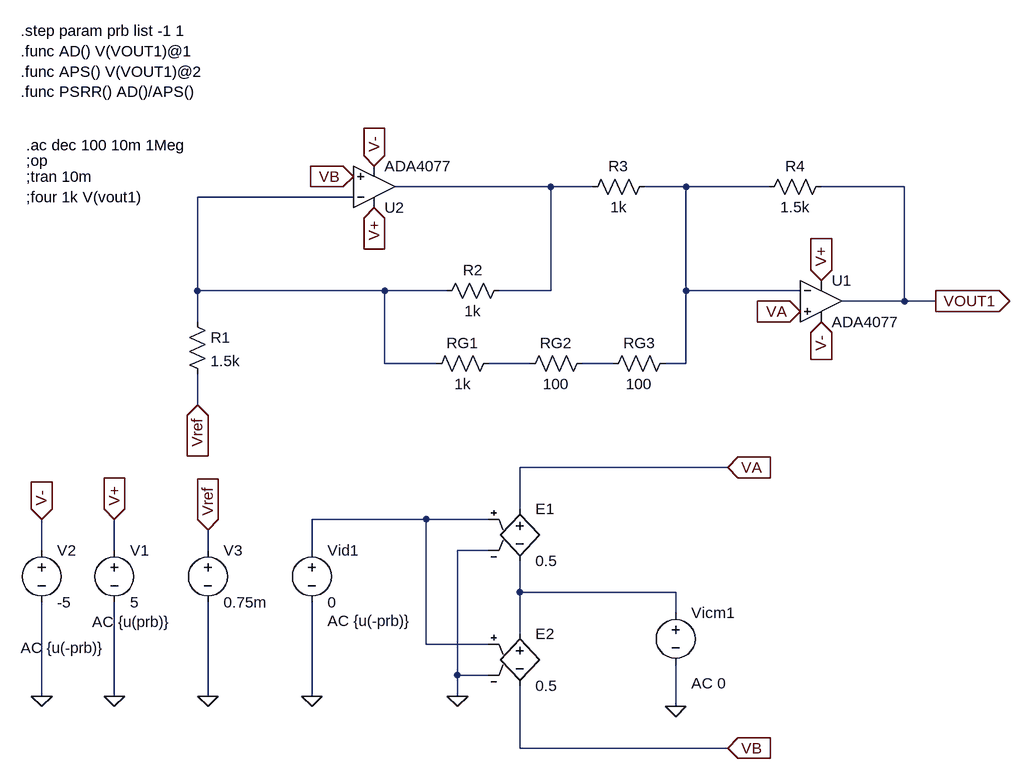
[diagram p0: schematic Etaj1PSRR.asc]
Etaj1PSRR.asc, the LTspice schematic file:
Version 4
SHEET 1 1100 776
WIRE 368 -160 128 -160
WIRE 432 -160 368 -160
WIRE 576 -160 512 -160
WIRE 704 -160 576 -160
WIRE 912 -160 784 -160
WIRE 64 -144 -176 -144
WIRE -176 0 -176 -144
WIRE 112 0 -176 0
WIRE 208 0 112 0
WIRE 368 0 368 -160
WIRE 368 0 288 0
WIRE 576 0 576 -160
WIRE 752 0 576 0
WIRE 912 16 912 -160
WIRE 912 16 816 16
WIRE 960 16 912 16
WIRE -176 48 -176 0
WIRE 112 112 112 0
WIRE 192 112 112 112
WIRE 336 112 272 112
WIRE 464 112 416 112
WIRE 576 112 576 0
WIRE 576 112 544 112
WIRE -176 176 -176 128
WIRE 640 272 320 272
WIRE 320 336 320 272
WIRE 176 352 0 352
WIRE 272 352 176 352
WIRE -416 400 -416 352
WIRE -304 400 -304 352
WIRE -160 400 -160 368
WIRE 0 400 0 352
WIRE 272 400 224 400
WIRE 320 464 320 416
WIRE 560 464 320 464
WIRE 560 496 560 464
WIRE 320 528 320 464
WIRE 176 544 176 352
WIRE 272 544 176 544
WIRE 224 592 224 400
WIRE 272 592 224 592
WIRE -416 624 -416 480
WIRE -304 624 -304 480
WIRE -160 624 -160 480
WIRE 0 624 0 480
WIRE 224 624 224 592
WIRE 560 640 560 576
WIRE 320 704 320 608
WIRE 640 704 320 704
FLAG -304 624 0
FLAG -416 624 0
FLAG -304 352 V+
IOPIN -304 352 In
FLAG -416 352 V-
IOPIN -416 352 In
FLAG 784 48 V-
IOPIN 784 48 In
FLAG 96 -192 V-
IOPIN 96 -192 In
FLAG 784 -16 V+
IOPIN 784 -16 In
FLAG 96 -128 V+
IOPIN 96 -128 In
FLAG 752 32 VA
IOPIN 752 32 In
FLAG 64 -176 VB
IOPIN 64 -176 In
FLAG 960 16 VOUT1
IOPIN 960 16 Out
FLAG 0 624 0
FLAG 224 624 0
FLAG 560 640 0
FLAG 640 272 VA
IOPIN 640 272 In
FLAG 640 704 VB
IOPIN 640 704 In
FLAG -160 368 Vref
IOPIN -160 368 In
FLAG -176 176 Vref
IOPIN -176 176 In
FLAG -160 624 0
DATAFLAG 912 16 ""
SYMBOL res -192 32 R0
SYMATTR InstName R1
SYMATTR Value 1.5k
SYMBOL res 304 -16 R90
WINDOW 0 0 56 VBottom 2
WINDOW 3 32 56 VTop 2
SYMATTR InstName R2
SYMATTR Value 1k
SYMBOL res 528 -176 R90
WINDOW 0 0 56 VBottom 2
WINDOW 3 32 56 VTop 2
SYMATTR InstName R3
SYMATTR Value 1k
SYMBOL res 800 -176 R90
WINDOW 0 0 56 VBottom 2
WINDOW 3 32 56 VTop 2
SYMATTR InstName R4
SYMATTR Value 1.5k
SYMBOL res 288 96 R90
WINDOW 0 0 56 VBottom 2
WINDOW 3 32 56 VTop 2
SYMATTR InstName RG1
SYMATTR Value 1k
SYMBOL voltage -304 384 R0
WINDOW 123 -34 126 Left 2
WINDOW 39 0 0 Left 0
SYMATTR Value2 AC {u(prb)}
SYMATTR InstName V1
SYMATTR Value 5
SYMBOL voltage -416 384 R0
WINDOW 123 -32 166 Left 2
WINDOW 39 0 0 Left 0
SYMATTR Value2 AC {u(-prb)}
SYMATTR InstName V2
SYMATTR Value -5
SYMBOL e 320 320 R0
SYMATTR InstName E1
SYMATTR Value 0.5
SYMBOL e 320 512 R0
SYMATTR InstName E2
SYMATTR Value 0.5
SYMBOL voltage 560 480 R0
WINDOW 123 24 124 Left 2
WINDOW 39 0 0 Left 0
SYMATTR Value2 AC 0
SYMATTR InstName Vicm1
SYMATTR Value ""
SYMBOL voltage 0 384 R0
WINDOW 123 24 124 Left 2
WINDOW 39 0 0 Left 0
SYMATTR Value2 AC {u(-prb)}
SYMATTR InstName Vid1
SYMATTR Value 0
SYMBOL voltage -160 384 R0
WINDOW 123 0 0 Left 0
WINDOW 39 0 0 Left 0
SYMATTR InstName V3
SYMATTR Value 0.75m
SYMBOL res 432 96 R90
WINDOW 0 0 56 VBottom 2
WINDOW 3 32 56 VTop 2
SYMATTR InstName RG2
SYMATTR Value 100
SYMBOL res 560 96 R90
WINDOW 0 0 56 VBottom 2
WINDOW 3 32 56 VTop 2
SYMATTR InstName RG3
SYMATTR Value 100
SYMBOL OpAmps\\ADA4077 784 -48 R0
SYMATTR InstName U1
SYMBOL OpAmps\\ADA4077 96 -96 M180
SYMATTR InstName U2
TEXT -440 -200 Left 2 !;op
TEXT -440 -224 Left 2 !.ac dec 100 10m 1Meg
TEXT -448 -400 Left 2 !.step param prb list -1 1\n.func AD() V(VOUT1)@1\n.func APS() V(VOUT1)@2\n.func PSRR() AD()/APS()
TEXT -440 -176 Left 2 !;tran 10m
TEXT -440 -144 Left 2 !;four 1k V(vout1)

The netlist it stands for:
* Etaj1PSRR.asc
R1 N003 Vref 1.5k
R2 N001 N003 1k
R3 N002 N001 1k
R4 VOUT1 N002 1.5k
RG1 N004 N003 1k
V1 V+ 0 5 AC {u(prb)}
V2 V- 0 -5 AC {u(-prb)}
E1 VA N007 N006 0 0.5
E2 N007 VB N006 0 0.5
Vicm1 N007 0 AC 0
Vid1 N006 0 0 AC {u(-prb)}
V3 Vref 0 0.75m
RG2 N005 N004 100
RG3 N002 N005 100
XU1 VA N002 V+ V- VOUT1 ADA4077  ; pins In+ In- V+ V- OUT
XU2 VB N003 V+ V- N001 ADA4077  ; pins In+ In- V+ V- OUT
;op
.ac dec 100 10m 1Meg
.step param prb list -1 1
.func AD() V(VOUT1)@1
.func APS() V(VOUT1)@2
.func PSRR() AD()/APS()
;tran 10m
;four 1k V(vout1)
.backanno
.end